# Altium project GEM_HV_channel.PrjPcb (part 1 of 2)
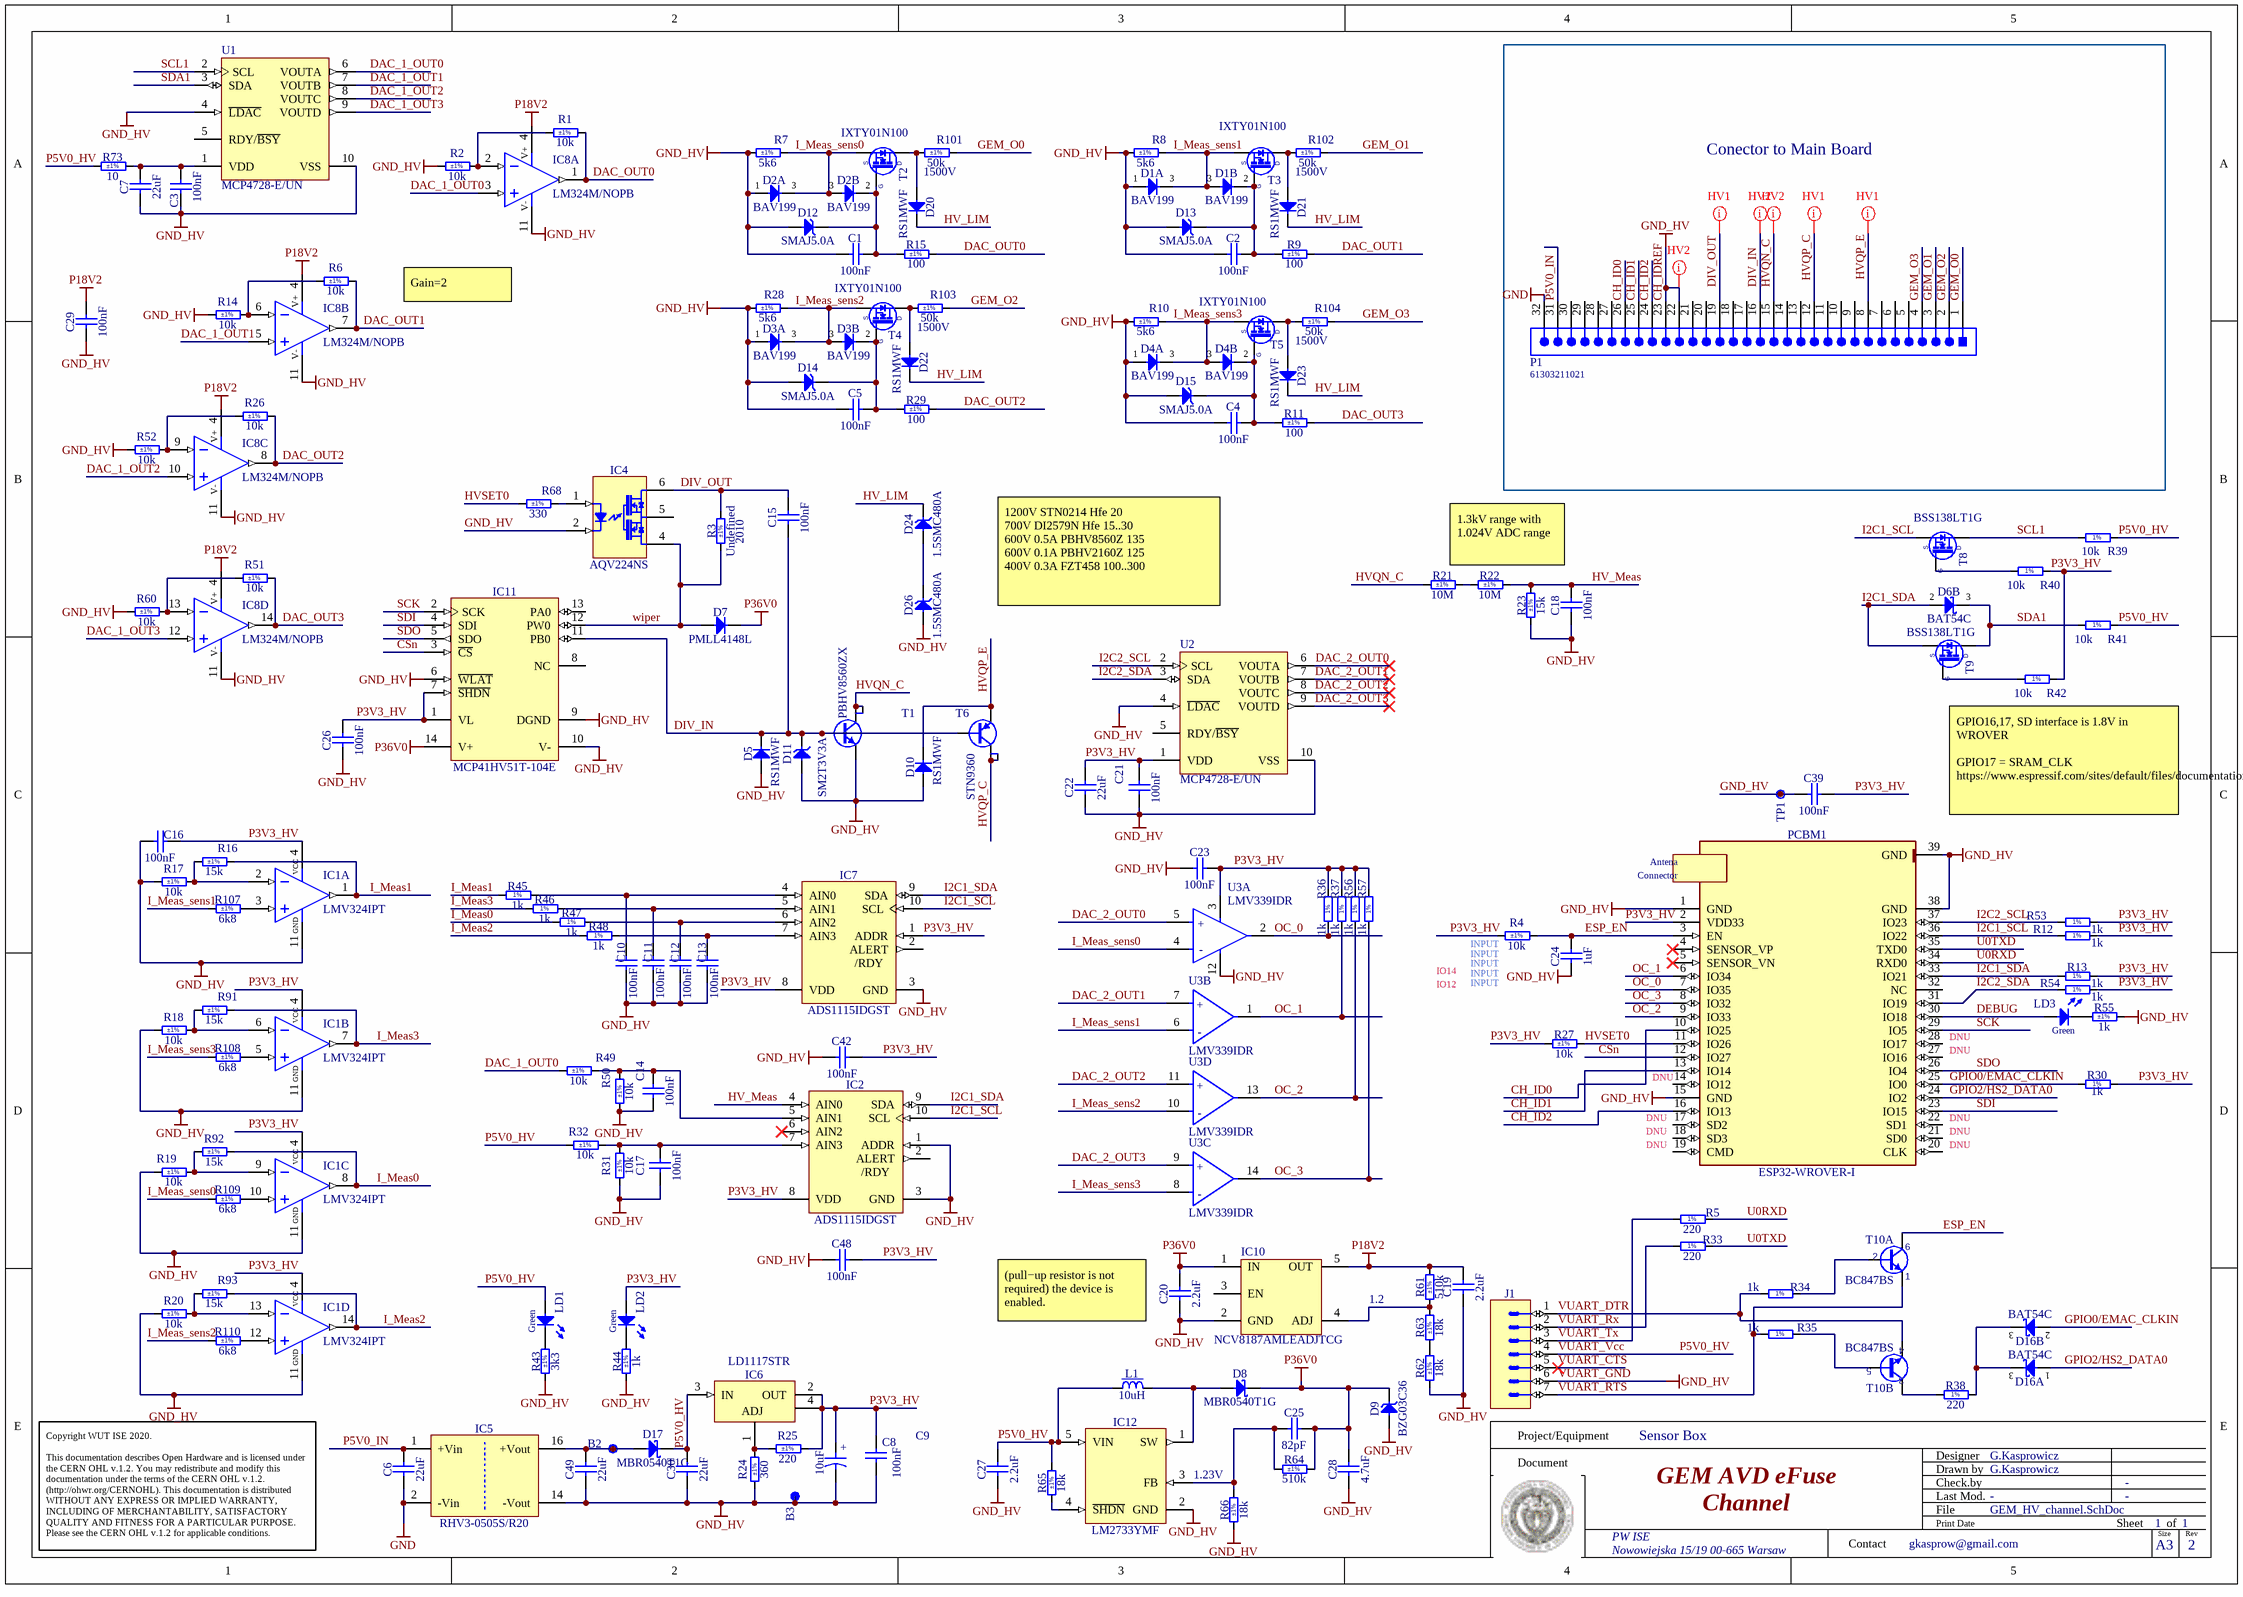
[diagram p0: GEM_HV_channel.SchDoc]
1 sheet, 166 parts. Net scope: hierarchical (ports join the sheet entries above them; power ports are global).
Board file: GEM_HV_channel.PcbDoc

## Sheet GEM_HV_channel.SchDoc: GEM AVD eFuse
size 420 x 297 mm; Author: G.Kasprowicz; CompanyName: WUT ISE; DrawnBy: G.Kasprowicz; Organization: WUT ISE; Address1: PW ISE; Address2: Nowowiejska 15/19 00-665 Warsaw; Address3: gkasprow@gmail.com; Revision: 2; SheetNumber: 1; SheetTotal: 1; ModifiedBy: -; CheckedDate: -; Title2: Channel; DivGrp: WUT ISE; Designer: G.Kasprowicz; ModifiedDate: -; ProjectName: Sensor Box

### Parts
B2  SMD Pad  [C100]  (value not drawn)
B3  SMD Pad  [C100]  (value not drawn)
C1  100nF  [CAPC1608X87N]
C2  100nF  [CAPC1608X87N]
C3  100nF  [CAPC1608X87N]
C4  100nF  [CAPC1608X87N]
C5  100nF  [CAPC1608X87N]
C6  22uF  [CAPC2012X145N]
C7  22uF  [CAPC2012X145N]
C8  10uF  [CAPAE430X540N]
C9  100nF  [CAPC1608X87N]
C10  100nF  [CAPC1608X87N]
C11  100nF  [CAPC1608X87N]
C12  100nF  [CAPC1608X87N]
C13  100nF  [CAPC1608X87N]
C14  100nF  [CAPC1608X87N]
C15  100nF  [CAPC4532X185N]
C16  100nF  [CAPC1608X87N]
C17  100nF  [CAPC1608X87N]
C18  100nF  [CAPC1608X87N]
C19  2.2uF  [CAPC1608X87N]
C20  2.2uF  [CAPC1608X87N]
C21  100nF  [CAPC1608X87N]
C22  22uF  [CAPC2012X145N]
C23  100nF  [CAPC1608X87N]
C24  1uF  [CAPC1608X87N]
C25  82pF  [CAPC1608X87N]
C26  100nF  [CAPC1608X87N]
C27  2.2uF  [CAPC1608X87N]
C28  4.7uF  [CAPC3225X270N]
C29  100nF  [CAPC1608X87N]
C30  22uF  [CAPC2012X145N]
C39  100nF  [CAPC1608X87N]
C42  100nF  [CAPC1608X87N]
C48  100nF  [CAPC1608X87N]
C49  22uF  [CAPC2012X145N]
D1  BAV199  [SOT95P240X110-3N]  (parts A,B of 2)
D2  BAV199  [SOT95P240X110-3N]  (parts A,B of 2)
D3  BAV199  [SOT95P240X110-3N]  (parts A,B of 2)
D4  BAV199  [SOT95P240X110-3N]  (parts A,B of 2)
D5  RS1MWF  [SOD-123F]
D6  BAT54C  [SOT95P240X130-3N]  (part B of 2)
D7  PMLL4148L  [DIOMELF3515N]
D8  MBR0540T1G  [SOD3716X135N]
D9  BZG03C36  [DIOM5326X230N]
D10  RS1MWF  [SOD-123F]
D11  SM2T3V3A  [DO-216AA]
D12  SMAJ5.0A  [DIOM5226X262N]
D13  SMAJ5.0A  [DIOM5226X262N]
D14  SMAJ5.0A  [DIOM5226X262N]
D15  SMAJ5.0A  [DIOM5226X262N]
D16  BAT54C  [SOT95P240X130-3N]  (parts A,B of 2)
D17  MBR0540T1G  [SOD3716X135N]
D20  RS1MWF  [SOD-123F]
D21  RS1MWF  [SOD-123F]
D22  RS1MWF  [SOD-123F]
D23  RS1MWF  [SOD-123F]
D24  1.5SMC480A  [DIOM7959X262N]
D26  1.5SMC480A  [DIOM7959X262N]
IC1  LMV324IPT  [SOP65P640X110-14N]  (parts A,B,C,D of 4)
IC2  ADS1115IDGST  [SOP50P490X110-10N]
IC4  AQV224NS  [PANASONIC_AQV22(SOP)]
IC5  RHV3-0505S/R20  [DCDC_RECOM_RHV3_Single]
IC6  LD1117STR  [SOT230P700X180-4N]
IC7  ADS1115IDGST  [SOP50P490X110-10N]
IC8  LM324M/NOPB  [SOIC127P600X175-14N]  (parts A,B,C,D of 4)
IC10  NCV8187AMLEADJTCG  [SOT23-5]
IC11  MCP41HV51T-104E  [SOP65P640X120-14N]
IC12  LM2733YMF  [SOT95P284X122-5N]
J1  Header 7  [SAMTEC_TSW-107-07-L-S-LL]  (value not drawn)
L1  10uH  [IND_TDK_VLCF5020-1]
LD1  Green  [LED_KINGBRIGHT_KP-1608CGCK]
LD2  Green  [LED_KINGBRIGHT_KP-1608CGCK]
LD3  Green  [LED_KINGBRIGHT_KP-1608CGCK]
P1  61303211021  [61303211021]
PCBM1  ESP32-WROVER-I  [PCBM_ESP32-WROVER-I]
R1  10k  Tolerance: ±1%  [RESC1608X55N]
R2  10k  Tolerance: ±1%  [RESC1608X55N]
R3  Undefined  Tolerance: ±1%  Case: 2010  [RES_VISHAY_CRHV2010A]
R4  10k  Tolerance: ±1%  [RESC1608X55N]
R5  220  [RESC1005X40N]
R6  10k  Tolerance: ±1%  [RESC1608X55N]
R7  5k6  Tolerance: ±1%  [RESC2012X60N]
R8  5k6  Tolerance: ±1%  [RESC2012X60N]
R9  100  Tolerance: ±1%  [RESC1608X55N]
R10  5k6  Tolerance: ±1%  [RESC2012X60N]
R11  100  Tolerance: ±1%  [RESC1608X55N]
R12  1k  [RESC1005X40N]
R13  1k  [RESC1005X40N]
R14  10k  Tolerance: ±1%  [RESC1608X55N]
R15  100  Tolerance: ±1%  [RESC1608X55N]
R16  15k  Tolerance: ±1%  [RESC1608X55N]
R17  10k  Tolerance: ±1%  [RESC1608X55N]
R18  10k  Tolerance: ±1%  [RESC1608X55N]
R19  10k  Tolerance: ±1%  [RESC1608X55N]
R20  10k  Tolerance: ±1%  [RESC1608X55N]
R21  10M  Tolerance: ±1%  [RESC5025X65N]
R22  10M  Tolerance: ±1%  [RESC5025X65N]
R23  15k  Tolerance: ±1%  [RESC1608X55N]
R24  360  Tolerance: ±1%  [RESC1608X55N]
R25  220  Tolerance: ±1%  [RESC1608X55N]
R26  10k  Tolerance: ±1%  [RESC1608X55N]
R27  10k  Tolerance: ±1%  [RESC1608X55N]
R28  5k6  Tolerance: ±1%  [RESC2012X60N]
R29  100  Tolerance: ±1%  [RESC1608X55N]
R30  1k  [RESC1005X40N]
R31  10k  Tolerance: ±1%  [RESC1608X55N]
R32  10k  Tolerance: ±1%  [RESC1608X55N]
R33  220  [RESC1005X40N]
R34  1k  [RESC1005X40N]
R35  1k  [RESC1005X40N]
R36  1k  [RESC1005X40N]
R37  1k  [RESC1005X40N]
R38  220  [RESC1005X40N]
R39  10k  [RESC1005X40N]
R40  10k  [RESC1005X40N]
R41  10k  [RESC1005X40N]
R42  10k  [RESC1005X40N]
R43  3k3  Tolerance: ±1%  [RESC1005X40N]
R44  1k  Tolerance: ±1%  [RESC1005X40N]
R45  1k  [RESC1005X40N]
R46  1k  [RESC1005X40N]
R47  1k  [RESC1005X40N]
R48  1k  [RESC1005X40N]
R49  10k  Tolerance: ±1%  [RESC1608X55N]
R50  10k  Tolerance: ±1%  [RESC1608X55N]
R51  10k  Tolerance: ±1%  [RESC1608X55N]
R52  10k  Tolerance: ±1%  [RESC1608X55N]
R53  1k  [RESC1005X40N]
R54  1k  [RESC1005X40N]
R55  1k  Tolerance: ±1%  [RESC1005X40N]
R56  1k  [RESC1005X40N]
R57  1k  [RESC1005X40N]
R60  10k  Tolerance: ±1%  [RESC1608X55N]
R61  510k  Tolerance: ±1%  [RESC1608X55N]
R62  18k  Tolerance: ±1%  [RESC1608X55N]
R63  18k  Tolerance: ±1%  [RESC1608X55N]
R64  510k  Tolerance: ±1%  [RESC1608X55N]
R65  18k  Tolerance: ±1%  [RESC1608X55N]
R66  18k  Tolerance: ±1%  [RESC1608X55N]
R68  330  Tolerance: ±1%  [RESC1005X40N]
R73  10  Tolerance: ±1%  [RESC1005X40N]
R91  15k  Tolerance: ±1%  [RESC1608X55N]
R92  15k  Tolerance: ±1%  [RESC1608X55N]
R93  15k  Tolerance: ±1%  [RESC1608X55N]
R101  50k  Tolerance: ±1%  Voltage: 1500V  [RES_SEI_HVC1206]
R102  50k  Tolerance: ±1%  Voltage: 1500V  [RES_SEI_HVC1206]
R103  50k  Tolerance: ±1%  Voltage: 1500V  [RES_SEI_HVC1206]
R104  50k  Tolerance: ±1%  Voltage: 1500V  [RES_SEI_HVC1206]
R107  6k8  Tolerance: ±1%  [RESC1608X55N]
R108  6k8  Tolerance: ±1%  [RESC1608X55N]
R109  6k8  Tolerance: ±1%  [RESC1608X55N]
R110  6k8  Tolerance: ±1%  [RESC1608X55N]
T1  PBHV8560ZX  [SOT230P700X180-4N]
T2  IXTY01N100  [TO228P991X238-3N-R648X546]
T3  IXTY01N100  [TO228P991X238-3N-R648X546]
T4  IXTY01N100  [TO228P991X238-3N-R648X546]
T5  IXTY01N100  [TO228P991X238-3N-R648X546]
T6  STN9360  [SOT230P700X180-4N]
T8  BSS138LT1G  [SOT95P240X110-3N]
T9  BSS138LT1G  [SOT95P240X110-3N]
T10  BC847BS  [SOT65P210X110-6N]  (parts A,B of 2)
TP1  (no value)  [TYCO_RCT-0C]
U1  MCP4728-E/UN  [MSOP-UN10_N]
U2  MCP4728-E/UN  [MSOP-UN10_N]
U3  LMV339IDR  [FP-D0014A-MFG]  (parts A,B,C,D of 4)

### Blocks framed on the sheet
Conector to Main Board: P1

### Nets
GND: C6.1 IC5.2(-Vin) P1.32
GND_HV: B3.1 C1.1 C2.1 C3.1 C4.1 C5.1 C7.1 C8.2 C9.1 C10.1 C11.1 C12.1 C13.1 C14.1 C16.1 C17.1 C18.1 C19.1 C20.1 C21.1 C22.1 C23.1 C24.1 C26.1 C27.1 C28.1 C29.1 C30.1 C39.1 C42.1 C48.1 C49.1 D1.1(A) D2.1(A) D3.1(A) D4.1(A) D5.2(A) D9.2(A) D10.2(A) D11.2(A) D12.2(A) D13.2(A) D14.2(A) D15.2(A) D26.2(A) IC1.11(GND) IC2.1(ADDR) IC2.3(GND) IC4.2(K) IC5.14(-Vout) IC7.3(GND) IC8.11(V-) IC10.2(GND) IC11.6(~{WLAT}) IC11.9(DGND) IC11.10(V-) IC12.2(GND) J1.6 P1.22 P1.23 PCBM1.1(GND) PCBM1.15(GND) PCBM1.38(GND) PCBM1.39(GND) R2.1 R7.1 R8.1 R10.1 R14.1 R17.1 R18.1 R19.1 R20.1 R23.1 R24.1 R28.1 R31.1 R43.1 R44.1 R50.1 R52.1 R55.2 R60.1 R62.1 R66.1 T1.3(E) TP1.1 U1.4(~{LDAC}) U1.10(VSS) U2.4(~{LDAC}) U2.10(VSS) U3.12(GND)  [also labelled CH_IDREF, VUART_GND]
P18V2: C19.2 C29.2 IC8.4(V+) IC10.5(OUT) R61.2
P36V0: C20.2 C25.2 C28.2 D7.1(C) D8.1(C) D9.1(C) IC10.1(IN) IC11.14(V+) R64.2
CH_ID0: P1.26 PCBM1.10(IO25)
CH_ID1: P1.25 PCBM1.13(IO14)
CH_ID2: P1.24 PCBM1.16(IO13)
CSn: IC11.3(~{CS}) PCBM1.12(IO27)
DAC_1_OUT0: IC8.3(IN+) R49.1 U1.6(VOUTA)
DAC_1_OUT1: IC8.5(IN+) U1.7(VOUTB)
DAC_1_OUT2: IC8.10(IN+) U1.8(VOUTC)
DAC_1_OUT3: IC8.12(IN+) U1.9(VOUTD)
DAC_2_OUT0: U2.6(VOUTA) U3.5(1IN+)
DAC_2_OUT1: U2.7(VOUTB) U3.7(2IN+)
DAC_2_OUT2: U2.8(VOUTC) U3.11(4IN+)
DAC_2_OUT3: U2.9(VOUTD) U3.9(3IN+)
DAC_OUT0: IC8.1(OUT) R1.2 R15.2
DAC_OUT1: IC8.7(OUT) R6.2 R9.2
DAC_OUT2: IC8.8(OUT) R26.2 R29.2
DAC_OUT3: IC8.14(OUT) R11.2 R51.2
DEBUG: LD3.2(A) PCBM1.30(IO18)
DIV_IN: C15.1 D5.1(C) D11.1(C) IC11.11(PB0) P1.16 T1.1(B) T6.1(B)
DIV_OUT: C15.2 IC4.6 P1.19 R3.2
ESP_EN: C24.2 PCBM1.3(EN) R4.2 T10.6(C)
GEM_O0: P1.1 R101.2
GEM_O1: P1.3 R102.2
GEM_O2: P1.2 R103.2
GEM_O3: P1.4 R104.2
GPIO0/EMAC_CLKIN: D16.2(A) PCBM1.25(IO0) R30.1
GPIO2/HS2_DATA0: D16.1(A) PCBM1.24(IO2)
HV_LIM: D20.1(C) D21.1(C) D22.1(C) D23.1(C) D24.1(C)
HV_Meas: C18.2 IC2.4(AIN0) R22.2 R23.2
HVQN_C: P1.15 R21.1 T1.2(C) T1.4(C)
HVQP_C: P1.12 T6.2(C) T6.4(C)
HVQP_E: D10.1(C) P1.8 T6.3(E)
HVSET0: PCBM1.11(IO26) R27.2 R68.1
I2C1_SCL: IC2.10(SCL) IC7.10(SCL) PCBM1.36(IO22) R12.1 T8.2(S)
I2C1_SDA: D6.2(A) IC2.9(SDA) IC7.9(SDA) PCBM1.33(IO21) R13.1 T9.2(S)
I2C2_SCL: PCBM1.37(IO23) R53.1 U2.2(SCL)
I2C2_SDA: PCBM1.31(IO19) R54.1 U2.3(SDA)
I_Meas0: IC1.8(OUT) R47.1 R92.2
I_Meas1: IC1.1(OUT) R16.2 R45.1
I_Meas2: IC1.14(OUT) R48.1 R93.2
I_Meas3: IC1.7(OUT) R46.1 R91.2
I_Meas_sens0: D2.3(COMAC) R7.2 R109.1 T2.2(S) U3.4(1IN-)
I_Meas_sens1: D1.3(COMAC) R8.2 R107.1 T3.2(S) U3.6(2IN-)
I_Meas_sens2: D3.3(COMAC) R28.2 R110.1 T4.2(S) U3.10(4IN-)
I_Meas_sens3: D4.3(COMAC) R10.2 R108.1 T5.2(S) U3.8(3IN-)
OC_0: PCBM1.7(IO35) R36.1 U3.2(1OUT)
OC_1: PCBM1.6(IO34) R37.1 U3.1(2OUT)
OC_2: PCBM1.9(IO33) R56.1 U3.13(4OUT)
OC_3: PCBM1.8(IO32) R57.1 U3.14(3OUT)
P3V3_HV: C8.1 C9.2 C16.2 C21.2 C22.2 C23.2 C26.2 C39.2 C42.2 C48.2 IC1.4(V+) IC2.8(VDD) IC6.2(OUT) IC6.4(OUT) IC7.1(ADDR) IC7.8(VDD) IC11.1(VL) IC11.7(~{SHDN}) LD2.2(A) PCBM1.2(VDD33) R4.1 R12.2 R13.2 R25.2 R27.1 R30.2 R36.2 R37.2 R40.2 R42.2 R53.2 R54.2 R56.2 R57.2 U2.1(VDD) U3.3(VCC+)
P5V0_HV: C27.2 C30.2 D17.1(C) IC6.3(IN) IC12.5(VIN) J1.4 L1.1 LD1.2(A) R32.1 R39.2 R41.2 R65.2 R73.1  [also labelled VUART_Vcc]
P5V0_IN: C6.2 IC5.1(+Vin) P1.31
SCK: IC11.2(SCK) PCBM1.29(IO5)
SCL1: R39.1 T8.3(D) U1.2(SCL)
SDA1: D6.3(COMC) R41.1 T9.3(D) U1.3(SDA)
SDI: IC11.4(SDI) PCBM1.23(IO15)
SDO: IC11.5(SDO) PCBM1.26(IO4)
U0RXD: PCBM1.34(RXD0) R5.2
U0TXD: PCBM1.35(TXD0) R33.2
VUART_CTS: J1.5
VUART_DTR: J1.1 R34.1 T10.4(E)
VUART_RTS: J1.7 R35.1 T10.1(E)
VUART_Rx: J1.2 R33.1
VUART_Tx: J1.3 R5.1
wiper: D7.2(A) IC4.4 IC11.12(PW0) R3.1
NetB2_1: B2.1 C49.2 D17.2(A) IC5.16(+Vout)
NetC1_2: C1.2 D2.2(C) D12.1(C) R15.1 T2.1(G)
NetC2_2: C2.2 D1.2(C) D13.1(C) R9.1 T3.1(G)
NetC3_2: C3.2 C7.2 R73.2 U1.1(VDD)
NetC4_2: C4.2 D4.2(C) D15.1(C) R11.1 T5.1(G)
NetC5_2: C5.2 D3.2(C) D14.1(C) R29.1 T4.1(G)
NetC10_2: C10.2 IC7.4(AIN0) R45.2
NetC11_2: C11.2 IC7.5(AIN1) R46.2
NetC12_2: C12.2 IC7.6(AIN2) R47.2
NetC13_2: C13.2 IC7.7(AIN3) R48.2
NetC14_2: C14.2 IC2.5(AIN1) R49.2 R50.2
NetC17_2: C17.2 IC2.7(AIN3) R31.2 R32.2
NetC25_1: C25.1 IC12.3(FB) R64.1 R66.2
NetD8_2: D8.2(A) IC12.1(SW) L1.2
NetD16_3: D16.3(COMC) R38.2
NetD20_2: D20.2(A) R101.1 T2.3(D)
NetD21_2: D21.2(A) R102.1 T3.3(D)
NetD22_2: D22.2(A) R103.1 T4.3(D)
NetD23_2: D23.2(A) R104.1 T5.3(D)
NetD24_2: D24.2(A) D26.1(C)
NetIC1_2: IC1.2(IN-) R16.1 R17.2
NetIC1_3: IC1.3(IN+) R107.2
NetIC1_5: IC1.5(IN+) R108.2
NetIC1_6: IC1.6(IN-) R18.2 R91.1
NetIC1_9: IC1.9(IN-) R19.2 R92.1
NetIC1_10: IC1.10(IN+) R109.2
NetIC1_12: IC1.12(IN+) R110.2
NetIC1_13: IC1.13(IN-) R20.2 R93.1
NetIC4_1: IC4.1(A) R68.2
NetIC6_1: IC6.1(ADJ) R24.2 R25.1
NetIC8_2: IC8.2(IN-) R1.1 R2.2
NetIC8_6: IC8.6(IN-) R6.1 R14.2
NetIC8_9: IC8.9(IN-) R26.1 R52.2
NetIC8_13: IC8.13(IN-) R51.1 R60.2
NetIC10_4: IC10.4(ADJ) R61.1 R63.2
NetIC12_4: IC12.4(~{SHDN}) R65.1
NetLD1_1: LD1.1(C) R43.2
NetLD2_1: LD2.1(C) R44.2
NetLD3_1: LD3.1(C) R55.1
NetR21_2: R21.2 R22.1
NetR34_2: R34.2 T10.2(B)
NetR35_2: R35.2 T10.5(B)
NetR38_1: R38.1 T10.3(C)
NetR40_1: R40.1 T8.1(G)
NetR42_1: R42.1 T9.1(G)
NetR62_2: R62.2 R63.1

Not connected (* = marked no-connect by the designer): IC2 2(ALERT) 6(AIN2)*; IC4 5; IC7 2(ALERT); IC10 3(EN); IC11 8(NC) 13(PA0); P1 5 6 7 9 10 11 13 14 17 18 20 21 27 28 29 30; PCBM1 4(SENSOR_VP)* 5(SENSOR_VN)* 14(IO12) 17(SD2) 18(SD3) 19(CMD) 20(CLK) 21(SD0) 22(SD1) 27(IO16) 28(IO17) 32(NC); U1 5(RDY/~{BSY}); U2 5(RDY/~{BSY})

### Layout directives
net class HV2: DIV_IN, GND_HV, HVQN_C
net class HV1: DIV_OUT, HVQP_C, HVQP_E

### Notes on the sheet
- Gain=2
- 1.3kV range with 1.024V ADC range
- 1200V STN0214 Hfe 20
  700V DI2579N Hfe 15..30
  600V 0.5A PBHV8560Z 135
  600V 0.1A PBHV2160Z 125
  400V 0.3A FZT458 100..300
- GPIO16,17, SD interface is 1.8V in WROVER
  GPIO17 = SRAM_CLK
  https://www.espressif.com/sites/default/files/documentation/esp32-wrover-e_esp32-wrover-ie_datasheet_en.pdf
- IO14
- IO12
- (near R4) INPUT
- (near PCBM1) DNU
- (near C20) (pull−up resistor is not required) the device is enabled.
- 1.2
- 1.23V
- Project/Equipment
- Document
- Designer
- Drawn by
- Check.by
- Copyright WUT ISE 2020.
  This documentation describes Open Hardware and is licensed under the CERN OHL v.1.2. You may redistribute and modify this documentation under the terms of the CERN OHL v.1.2. (http://ohwr.org/CERNOHL). This documentation is distributed WITHOUT ANY EXPRESS OR IMPLIED WARRANTY, INCLUDING OF MERCHANTABILITY, SATISFACTORY QUALITY AND FITNESS FOR A PARTICULAR PURPOSE. Please see the CERN OHL v.1.2 for applicable conditions.
- Contact
- File
- Last Mod.
- Print Date
- Sheet
- Size
- A3
- of
- Rev
- (in symbol ADS1115IDGST) /RDY
- (in symbol CAE430-540_10UF_16V_20%) +
- (in symbol CMP-04896-000053-1, part A) +; -
- (in symbol CMP-04896-000053-1, part B) +; -
- (in symbol CMP-04896-000053-1, part C) +; -
- (in symbol CMP-04896-000053-1, part D) +; -
- (in symbol OA_LMV324_TSSOP, part A) VCC
- (in symbol OA_LMV324_TSSOP, part B) VCC
- (in symbol OA_LMV324_TSSOP, part C) VCC
- (in symbol OA_LMV324_TSSOP, part D) VCC
- (in symbol PCBM_ESP32-WROVER-I) Antena; Connector
- (in symbol R0402_1K_1%_0.0625W_100PPM) 1%
- (in symbol R0402_10K_1%_0.0625W_100PPM) 1%
- (in symbol R0402_220R_1%_0.0625W_100PPM) 1%